# Altium schematic sheet 3.VoLTE.SchDoc
size A4
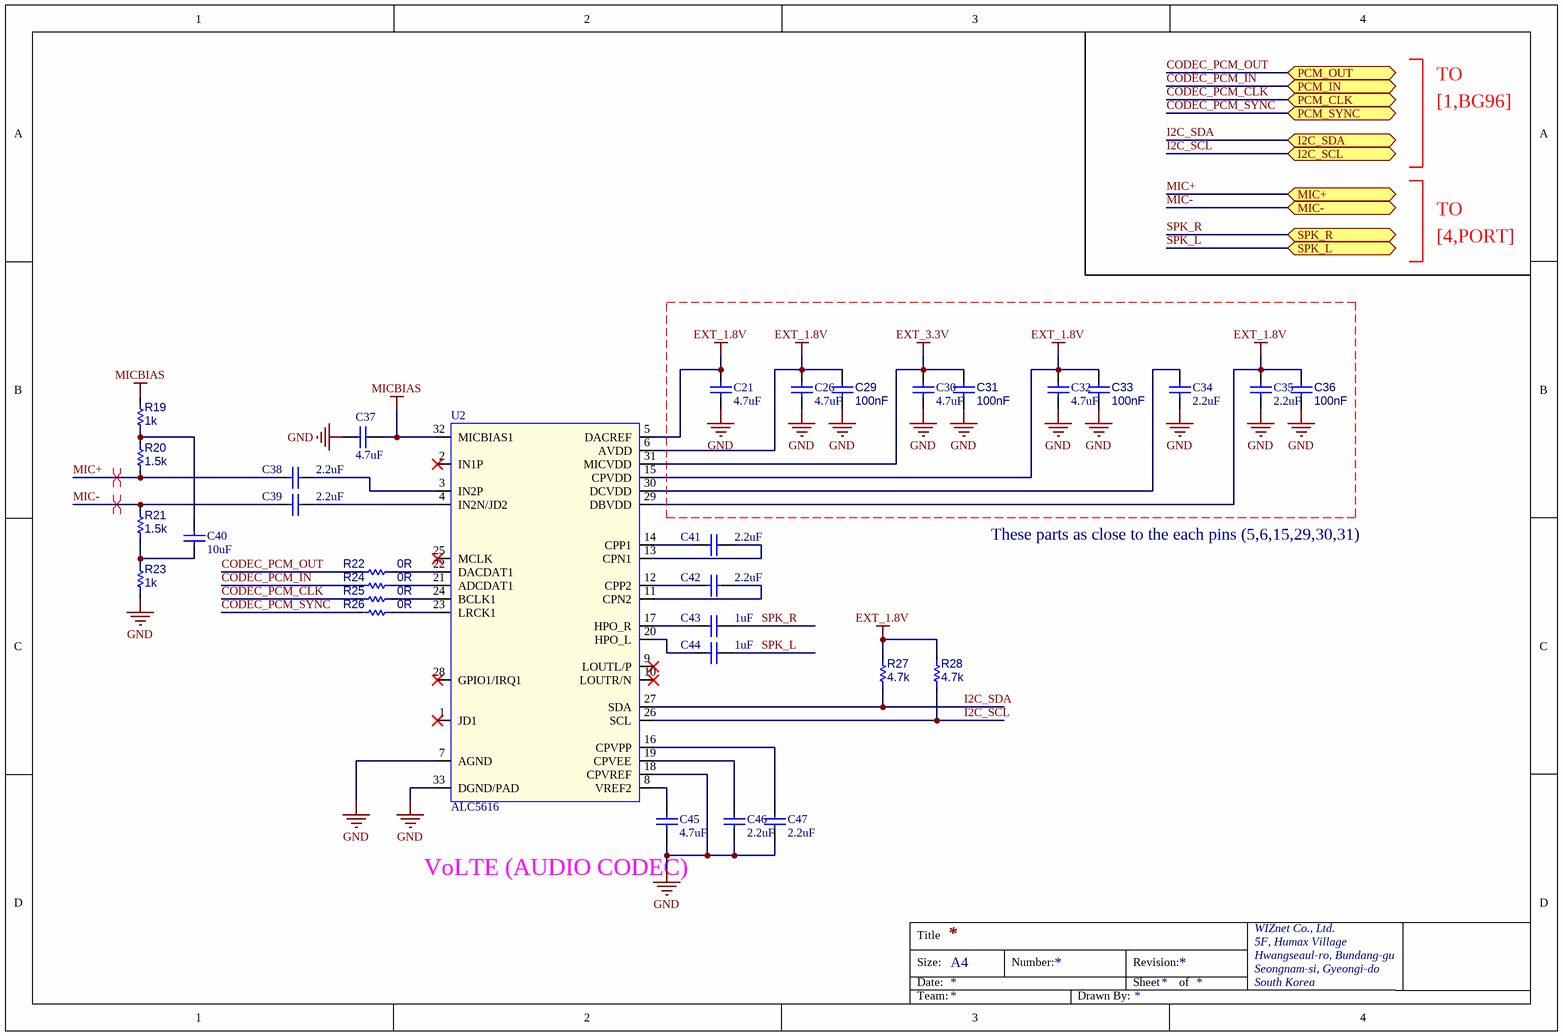
[diagram p0: 3.VoLTE.SchDoc]

## Parts
C21  4.7uF  [CAP-0603]
C26  4.7uF  [CAP-0603]
C29  100nF  [CAP-0402]
C30  4.7uF  [CAP-0603]
C31  100nF  [CAP-0402]
C32  4.7uF  [CAP-0603]
C33  100nF  [CAP-0402]
C34  2.2uF  [CAP-0603]
C35  2.2uF  [CAP-0603]
C36  100nF  [CAP-0402]
C37  4.7uF  [CAP-0603]
C38  2.2uF  [CAP-0603]
C39  2.2uF  [CAP-0603]
C40  10uF  [CAP-0603]
C41  2.2uF  [CAP-0603]
C42  2.2uF  [CAP-0603]
C43  1uF  [CAP-0603]
C44  1uF  [CAP-0603]
C45  4.7uF  [CAP-0603]
C46  2.2uF  [CAP-0603]
C47  2.2uF  [CAP-0603]
R19  1k  [RES-0402]
R20  1.5k  [RES-0402]
R21  1.5k  [RES-0402]
R22  0R  [RES-0402]
R23  1k  [RES-0402]
R24  0R  [RES-0402]
R25  0R  [RES-0402]
R26  0R  [RES-0402]
R27  4.7k  [RES-0402]
R28  4.7k  [RES-0402]
U2  ALC5616  [QFN32(0.4/4X4)]

## Ports
I2C_SCL, I2C_SDA, MIC+, MIC-, PCM_CLK, PCM_IN, PCM_OUT, PCM_SYNC, SPK_L, SPK_R

## Nets
EXT_1.8V: C21.2 C26.2 C29.2 C32.2 C33.2 C35.2 C36.2 R27.2 R28.2 U2.5(DACREF) U2.6(AVDD) U2.15(CPVDD) U2.29(DBVDD)
EXT_3.3V: C30.2 C31.2 U2.31(MICVDD)
GND: C21.1 C26.1 C29.1 C30.1 C31.1 C32.1 C33.1 C34.1 C35.1 C36.1 C37.1 C45.1 C46.1 C47.1 R23.1 U2.7(AGND) U2.18(CPVREF) U2.33(DGND/PAD)
MICBIAS: C37.2 R19.2 U2.32(MICBIAS1)
CODEC_PCM_CLK: R25.1 ; port PCM_CLK
CODEC_PCM_IN: R24.1 ; port PCM_IN
CODEC_PCM_OUT: R22.1 ; port PCM_OUT
CODEC_PCM_SYNC: R26.1 ; port PCM_SYNC
I2C_SCL: R28.1 U2.26(SCL) ; port I2C_SCL
I2C_SDA: R27.1 U2.27(SDA) ; port I2C_SDA
MIC+: C38.1 R20.1 ; port MIC+
MIC-: C39.1 R21.2 ; port MIC-
SPK_L: C44.2 ; port SPK_L
SPK_R: C43.2 ; port SPK_R
NetC34_2: C34.2 U2.30(DCVDD)
NetC38_2: C38.2 U2.3(IN2P)
NetC39_2: C39.2 U2.4(IN2N/JD2)
NetC40_1: C40.1 R21.1 R23.2
NetC40_2: C40.2 R19.1 R20.2
NetC41_1: C41.1 U2.14(CPP1)
NetC41_2: C41.2 U2.13(CPN1)
NetC42_1: C42.1 U2.12(CPP2)
NetC42_2: C42.2 U2.11(CPN2)
NetC43_1: C43.1 U2.17(HPO_R)
NetC44_1: C44.1 U2.20(HPO_L)
NetC45_2: C45.2 U2.8(VREF2)
NetC46_2: C46.2 U2.19(CPVEE)
NetC47_2: C47.2 U2.16(CPVPP)
NetR22_2: R22.2 U2.22(DACDAT1)
NetR24_2: R24.2 U2.21(ADCDAT1)
NetR25_2: R25.2 U2.24(BCLK1)
NetR26_2: R26.2 U2.23(LRCK1)

Not connected (* = marked no-connect by the designer): U2 1(JD1)* 2(IN1P)* 9(LOUTL/P)* 10(LOUTR/N)* 25(MCLK)* 28(GPIO1/IRQ1)*

## Layout directives
differential pair: MIC+, MIC-

## Notes on the sheet
- [1,BG96]
- TO
- [4,PORT]
- These parts as close to the each pins (5,6,15,29,30,31)
- (near C45) VoLTE (AUDIO CODEC)
- Title
- Size:
- Date:
- A4
- Number:
- Revision:
- Sheet
- of
- WIZnet Co., Ltd.
- 5F, Humax Village
- Hwangseaul-ro, Bundang-gu
- Seongnam-si, Gyeongi-do
- South Korea
- Team:
- Drawn By:

## Library data of the parts
C21 C26 C30 C32 C34 C35 C37-C47 = CAP-0603: Ceramic CAP 0603(1608)
C29 C31 C33 C36 = CAP-0402: Ceramic CAP 0402(1005)
R19-R28 = RES-0402
U2 = ALC5616: AUDIO CODEC with QUECTEL VOLTE